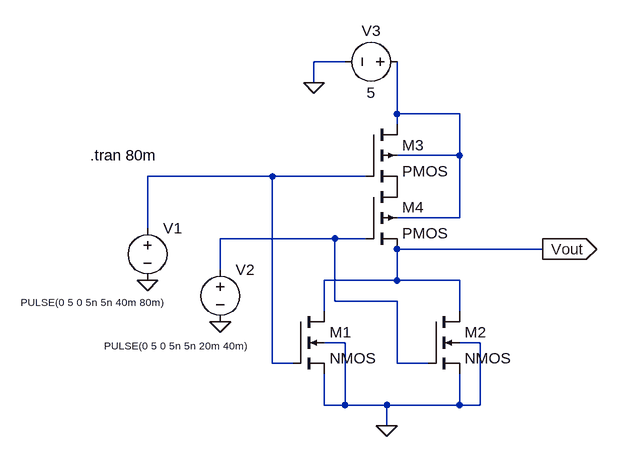
[diagram p0: schematic CMOS NOR.asc]
CMOS NOR.asc, the LTspice schematic file:
Version 4
SHEET 1 880 680
WIRE 160 -192 112 -192
WIRE 112 -160 112 -192
WIRE 240 -112 240 -192
WIRE 336 -112 240 -112
WIRE 240 -96 240 -112
WIRE 336 -48 336 -112
WIRE 336 -48 240 -48
WIRE 48 -16 -144 -16
WIRE 192 -16 48 -16
WIRE 336 48 336 -48
WIRE 336 48 240 48
WIRE -144 64 -144 -16
WIRE 144 80 -32 80
WIRE 192 80 144 80
WIRE 464 96 240 96
WIRE -32 128 -32 80
WIRE 240 144 240 96
WIRE 240 144 128 144
WIRE 336 144 240 144
WIRE 144 176 144 80
WIRE 240 176 144 176
WIRE 128 192 128 144
WIRE 336 192 336 144
WIRE 160 240 128 240
WIRE 368 240 336 240
WIRE 48 272 48 -16
WIRE 80 272 48 272
WIRE 240 272 240 176
WIRE 288 272 240 272
WIRE 128 336 128 288
WIRE 160 336 160 240
WIRE 160 336 128 336
WIRE 224 336 160 336
WIRE 336 336 336 288
WIRE 336 336 224 336
WIRE 368 336 368 240
WIRE 368 336 336 336
WIRE 224 368 224 336
FLAG -144 144 0
FLAG -32 208 0
FLAG 224 368 0
FLAG 112 -160 0
FLAG 464 96 Vout
IOPIN 464 96 Out
SYMBOL nmos4 80 192 R0
SYMATTR InstName M1
SYMBOL nmos4 288 192 R0
SYMATTR InstName M2
SYMBOL pmos4 192 -96 R0
SYMATTR InstName M3
SYMBOL pmos4 192 0 R0
SYMATTR InstName M4
SYMBOL voltage -144 48 R0
WINDOW 3 -195 130 Left 1
WINDOW 123 0 0 Left 0
WINDOW 39 0 0 Left 0
SYMATTR InstName V1
SYMATTR Value PULSE(0 5 0 5n 5n 40m 80m)
SYMBOL voltage -32 112 R0
WINDOW 3 -179 133 Left 1
WINDOW 123 0 0 Left 0
WINDOW 39 0 0 Left 0
SYMATTR InstName V2
SYMATTR Value PULSE(0 5 0 5n 5n 20m 40m)
SYMBOL voltage 256 -192 R90
WINDOW 0 -32 56 VBottom 2
WINDOW 3 32 56 VTop 2
WINDOW 123 0 0 Left 0
WINDOW 39 0 0 Left 0
SYMATTR InstName V3
SYMATTR Value 5
TEXT -232 -48 Left 2 !.tran 80m

The netlist it stands for:
* CMOS NOR.asc
M1 Vout N002 0 0 NMOS
M2 Vout N003 0 0 NMOS
M3 N001 N002 P001 N001 PMOS
M4 P001 N003 Vout N001 PMOS
V1 N002 0 PULSE(0 5 0 5n 5n 40m 80m)
V2 N003 0 PULSE(0 5 0 5n 5n 20m 40m)
V3 N001 0 5
.model NMOS NMOS
.model PMOS PMOS
.lib standard.mos
.tran 80m
.backanno
.end